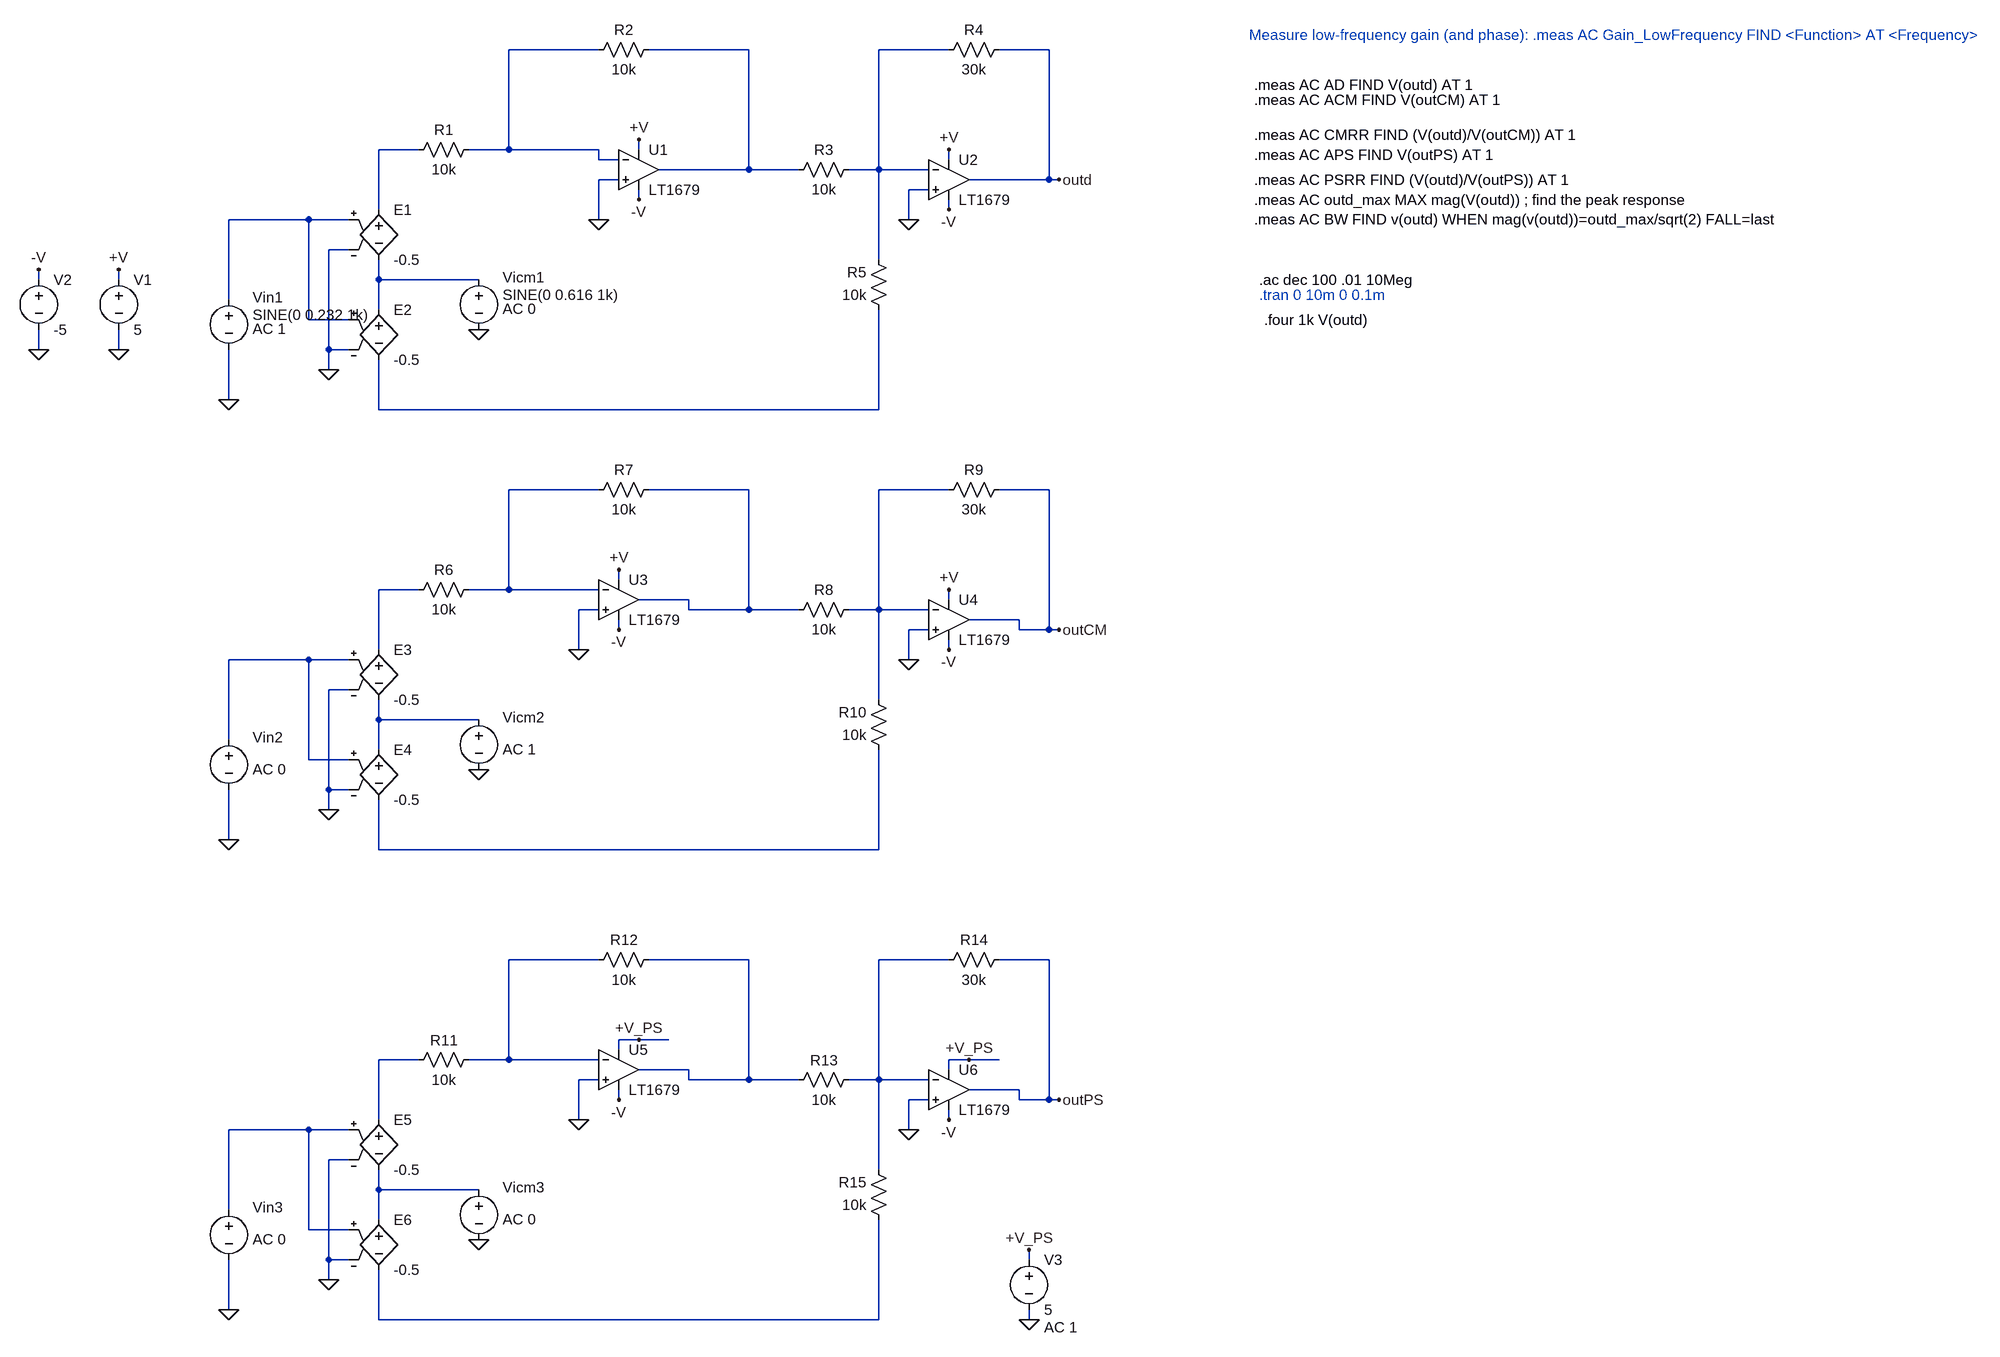
[diagram p0: schematic Etaj_1_AI_2AO_inv_AC.asc]
Etaj_1_AI_2AO_inv_AC.asc, the LTspice schematic file:
Version 4.1
SHEET 1 2388 2108
WIRE 96 48 -48 48
WIRE 336 48 176 48
WIRE 656 48 544 48
WIRE 816 48 736 48
WIRE -192 208 -256 208
WIRE -48 208 -48 48
WIRE -48 208 -112 208
WIRE 96 208 -48 208
WIRE 160 208 160 192
WIRE 96 224 96 208
WIRE 128 224 96 224
WIRE 656 224 656 208
WIRE 336 240 336 48
WIRE 336 240 192 240
WIRE 416 240 336 240
WIRE 544 240 544 48
WIRE 544 240 496 240
WIRE 624 240 544 240
WIRE 128 256 96 256
WIRE 816 256 816 48
WIRE 816 256 688 256
WIRE 832 256 816 256
WIRE 624 272 592 272
WIRE 160 288 160 272
WIRE -256 304 -256 208
WIRE 656 304 656 288
WIRE -368 320 -496 320
WIRE -304 320 -368 320
WIRE 96 320 96 256
WIRE 592 320 592 272
WIRE -304 368 -336 368
WIRE 544 384 544 240
WIRE -800 416 -800 400
WIRE -672 416 -672 400
WIRE -256 416 -256 384
WIRE -96 416 -256 416
WIRE -496 448 -496 320
WIRE -256 464 -256 416
WIRE -368 480 -368 320
WIRE -304 480 -368 480
WIRE -800 528 -800 496
WIRE -672 528 -672 496
WIRE -336 528 -336 368
WIRE -304 528 -336 528
WIRE -336 560 -336 528
WIRE -496 608 -496 528
WIRE -256 624 -256 544
WIRE 544 624 544 464
WIRE 544 624 -256 624
WIRE 96 752 -48 752
WIRE 336 752 176 752
WIRE 656 752 544 752
WIRE 816 752 736 752
WIRE 128 896 128 880
WIRE -192 912 -256 912
WIRE -48 912 -48 752
WIRE -48 912 -112 912
WIRE 96 912 -48 912
WIRE 240 928 160 928
WIRE 656 928 656 912
WIRE 96 944 64 944
WIRE 240 944 240 928
WIRE 336 944 336 752
WIRE 336 944 240 944
WIRE 416 944 336 944
WIRE 544 944 544 752
WIRE 544 944 496 944
WIRE 624 944 544 944
WIRE 768 960 688 960
WIRE 128 976 128 960
WIRE 624 976 592 976
WIRE 768 976 768 960
WIRE 816 976 816 752
WIRE 816 976 768 976
WIRE 832 976 816 976
WIRE -256 1008 -256 912
WIRE 64 1008 64 944
WIRE 656 1008 656 992
WIRE -368 1024 -496 1024
WIRE -304 1024 -368 1024
WIRE 592 1024 592 976
WIRE -304 1072 -336 1072
WIRE 544 1088 544 944
WIRE -256 1120 -256 1088
WIRE -96 1120 -256 1120
WIRE -496 1152 -496 1024
WIRE -256 1168 -256 1120
WIRE -368 1184 -368 1024
WIRE -304 1184 -368 1184
WIRE -336 1232 -336 1072
WIRE -304 1232 -336 1232
WIRE -336 1264 -336 1232
WIRE -496 1312 -496 1232
WIRE -256 1328 -256 1248
WIRE 544 1328 544 1168
WIRE 544 1328 -256 1328
WIRE 96 1504 -48 1504
WIRE 336 1504 176 1504
WIRE 656 1504 544 1504
WIRE 816 1504 736 1504
WIRE 160 1632 128 1632
WIRE 208 1632 160 1632
WIRE 128 1648 128 1632
WIRE -192 1664 -256 1664
WIRE -48 1664 -48 1504
WIRE -48 1664 -112 1664
WIRE 96 1664 -48 1664
WIRE 688 1664 656 1664
WIRE 736 1664 688 1664
WIRE 240 1680 160 1680
WIRE 656 1680 656 1664
WIRE 96 1696 64 1696
WIRE 240 1696 240 1680
WIRE 336 1696 336 1504
WIRE 336 1696 240 1696
WIRE 416 1696 336 1696
WIRE 544 1696 544 1504
WIRE 544 1696 496 1696
WIRE 624 1696 544 1696
WIRE 768 1712 688 1712
WIRE 128 1728 128 1712
WIRE 624 1728 592 1728
WIRE 768 1728 768 1712
WIRE 816 1728 816 1504
WIRE 816 1728 768 1728
WIRE 832 1728 816 1728
WIRE -256 1760 -256 1664
WIRE 64 1760 64 1696
WIRE 656 1760 656 1744
WIRE -368 1776 -496 1776
WIRE -304 1776 -368 1776
WIRE 592 1776 592 1728
WIRE -304 1824 -336 1824
WIRE 544 1840 544 1696
WIRE -256 1872 -256 1840
WIRE -96 1872 -256 1872
WIRE -496 1904 -496 1776
WIRE -256 1920 -256 1872
WIRE -368 1936 -368 1776
WIRE -304 1936 -368 1936
WIRE -336 1984 -336 1824
WIRE -304 1984 -336 1984
WIRE 784 1984 784 1968
WIRE -336 2016 -336 1984
WIRE -496 2064 -496 1984
WIRE -256 2080 -256 2000
WIRE 544 2080 544 1920
WIRE 544 2080 -256 2080
WIRE 784 2080 784 2064
FLAG -672 528 0
FLAG 160 192 +V
FLAG -672 400 +V
FLAG 160 288 -V
FLAG -800 528 0
FLAG -800 400 -V
FLAG 656 208 +V
FLAG 656 304 -V
FLAG 832 256 outd
FLAG 96 320 0
FLAG 592 320 0
FLAG -496 608 0
FLAG -336 560 0
FLAG -96 496 0
FLAG 128 880 +V
FLAG 128 976 -V
FLAG 656 912 +V
FLAG 656 1008 -V
FLAG 832 976 outCM
FLAG 64 1008 0
FLAG 592 1024 0
FLAG -496 1312 0
FLAG -336 1264 0
FLAG -96 1200 0
FLAG 128 1728 -V
FLAG 656 1760 -V
FLAG 832 1728 outPS
FLAG 64 1760 0
FLAG 592 1776 0
FLAG -496 2064 0
FLAG -336 2016 0
FLAG -96 1952 0
FLAG 784 2080 0
FLAG 784 1968 +V_PS
FLAG 688 1664 +V_PS
FLAG 160 1632 +V_PS
SYMBOL voltage -672 400 R0
WINDOW 123 0 0 Left 2
WINDOW 39 0 0 Left 2
SYMATTR InstName V1
SYMATTR Value 5
SYMBOL voltage -800 400 R0
WINDOW 123 0 0 Left 2
WINDOW 39 0 0 Left 2
SYMATTR InstName V2
SYMATTR Value -5
SYMBOL res -96 192 R90
WINDOW 0 0 56 VBottom 2
WINDOW 3 32 56 VTop 2
SYMATTR InstName R1
SYMATTR Value 10k
SYMBOL res 192 32 R90
WINDOW 0 0 56 VBottom 2
WINDOW 3 32 56 VTop 2
SYMATTR InstName R2
SYMATTR Value 10k
SYMBOL res 512 224 R90
WINDOW 0 0 56 VBottom 2
WINDOW 3 32 56 VTop 2
SYMATTR InstName R3
SYMATTR Value 10k
SYMBOL res 752 32 R90
WINDOW 0 0 56 VBottom 2
WINDOW 3 32 56 VTop 2
SYMATTR InstName R4
SYMATTR Value 30k
SYMBOL res 560 480 R180
WINDOW 0 36 76 Left 2
WINDOW 3 36 40 Left 2
SYMATTR InstName R5
SYMATTR Value 10k
SYMBOL voltage -496 432 R0
WINDOW 123 38 63 Left 2
WINDOW 39 0 0 Left 2
WINDOW 0 38 12 Left 2
WINDOW 3 38 40 Left 2
SYMATTR Value2 AC 1
SYMATTR InstName Vin1
SYMATTR Value SINE(0 0.232 1k)
SYMBOL e -256 288 R0
SYMATTR InstName E1
SYMATTR Value -0.5
SYMBOL e -256 448 R0
SYMATTR InstName E2
SYMATTR Value -0.5
SYMBOL voltage -96 400 R0
WINDOW 123 38 63 Left 2
WINDOW 39 0 0 Left 2
WINDOW 0 38 12 Left 2
WINDOW 3 38 40 Left 2
SYMATTR Value2 AC 0
SYMATTR InstName Vicm1
SYMATTR Value SINE(0 0.616 1k)
SYMBOL res -96 896 R90
WINDOW 0 0 56 VBottom 2
WINDOW 3 32 56 VTop 2
SYMATTR InstName R6
SYMATTR Value 10k
SYMBOL res 192 736 R90
WINDOW 0 0 56 VBottom 2
WINDOW 3 32 56 VTop 2
SYMATTR InstName R7
SYMATTR Value 10k
SYMBOL res 512 928 R90
WINDOW 0 0 56 VBottom 2
WINDOW 3 32 56 VTop 2
SYMATTR InstName R8
SYMATTR Value 10k
SYMBOL res 752 736 R90
WINDOW 0 0 56 VBottom 2
WINDOW 3 32 56 VTop 2
SYMATTR InstName R9
SYMATTR Value 30k
SYMBOL res 560 1184 R180
WINDOW 0 36 76 Left 2
WINDOW 3 36 40 Left 2
SYMATTR InstName R10
SYMATTR Value 10k
SYMBOL voltage -496 1136 R0
WINDOW 123 38 63 Left 2
WINDOW 39 0 0 Left 2
WINDOW 0 38 12 Left 2
WINDOW 3 -188 38 Left 2
SYMATTR Value2 AC 0
SYMATTR InstName Vin2
SYMATTR Value ""
SYMBOL e -256 992 R0
SYMATTR InstName E3
SYMATTR Value -0.5
SYMBOL e -256 1152 R0
SYMATTR InstName E4
SYMATTR Value -0.5
SYMBOL voltage -96 1104 R0
WINDOW 123 38 63 Left 2
WINDOW 39 0 0 Left 2
WINDOW 0 38 12 Left 2
WINDOW 3 -188 38 Left 2
SYMATTR Value2 AC 1
SYMATTR InstName Vicm2
SYMATTR Value ""
SYMBOL res -96 1648 R90
WINDOW 0 0 56 VBottom 2
WINDOW 3 32 56 VTop 2
SYMATTR InstName R11
SYMATTR Value 10k
SYMBOL res 192 1488 R90
WINDOW 0 0 56 VBottom 2
WINDOW 3 32 56 VTop 2
SYMATTR InstName R12
SYMATTR Value 10k
SYMBOL res 512 1680 R90
WINDOW 0 0 56 VBottom 2
WINDOW 3 32 56 VTop 2
SYMATTR InstName R13
SYMATTR Value 10k
SYMBOL res 752 1488 R90
WINDOW 0 0 56 VBottom 2
WINDOW 3 32 56 VTop 2
SYMATTR InstName R14
SYMATTR Value 30k
SYMBOL res 560 1936 R180
WINDOW 0 36 76 Left 2
WINDOW 3 36 40 Left 2
SYMATTR InstName R15
SYMATTR Value 10k
SYMBOL voltage -496 1888 R0
WINDOW 123 38 63 Left 2
WINDOW 39 0 0 Left 2
WINDOW 0 38 12 Left 2
WINDOW 3 -188 38 Left 2
SYMATTR Value2 AC 0
SYMATTR InstName Vin3
SYMATTR Value ""
SYMBOL e -256 1744 R0
SYMATTR InstName E5
SYMATTR Value -0.5
SYMBOL e -256 1904 R0
SYMATTR InstName E6
SYMATTR Value -0.5
SYMBOL voltage -96 1856 R0
WINDOW 123 38 63 Left 2
WINDOW 39 0 0 Left 2
WINDOW 0 38 12 Left 2
WINDOW 3 -188 38 Left 2
SYMATTR Value2 AC 0
SYMATTR InstName Vicm3
SYMATTR Value ""
SYMBOL voltage 784 1968 R0
WINDOW 123 24 124 Left 2
WINDOW 39 0 0 Left 2
SYMATTR Value2 AC 1
SYMATTR InstName V3
SYMATTR Value 5
SYMBOL OpAmps\\LT1679 160 240 R0
SYMATTR InstName U1
SYMBOL OpAmps\\LT1679 656 256 R0
SYMATTR InstName U2
SYMBOL OpAmps\\LT1679 128 928 R0
SYMATTR InstName U3
SYMBOL OpAmps\\LT1679 656 960 R0
SYMATTR InstName U4
SYMBOL OpAmps\\LT1679 128 1680 R0
SYMATTR InstName U5
SYMBOL OpAmps\\LT1679 656 1712 R0
SYMATTR InstName U6
TEXT 1152 416 Left 2 !.ac dec 100 .01 10Meg
TEXT 1144 104 Left 2 !.meas AC AD FIND V(outd) AT 1
TEXT 1136 24 Left 2 ;Measure low-frequency gain (and phase): .meas AC Gain_LowFrequency FIND <Function> AT <Frequency>
TEXT 1144 128 Left 2 !.meas AC ACM FIND V(outCM) AT 1
TEXT 1144 184 Left 2 !.meas AC CMRR FIND (V(outd)/V(outCM)) AT 1
TEXT 1144 256 Left 2 !.meas AC PSRR FIND (V(outd)/V(outPS)) AT 1
TEXT 1144 216 Left 2 !.meas AC APS FIND V(outPS) AT 1
TEXT 1144 288 Left 2 !.meas AC outd_max MAX mag(V(outd)) ; find the peak response\n.meas AC BW FIND v(outd) WHEN mag(v(outd))=outd_max/sqrt(2) FALL=last
TEXT 1152 440 Left 2 ;.tran 0 10m 0 0.1m
TEXT 1160 480 Left 2 !.four 1k V(outd)

The netlist it stands for:
* Etaj_1_AI_2AO_inv_AC.asc
V1 +V 0 5
V2 -V 0 -5
R1 N001 N004 10k
R2 N002 N001 10k
R3 N003 N002 10k
R4 outd N003 30k
R5 N007 N003 10k
Vin1 N005 0 SINE(0 0.232 1k) AC 1
E1 N004 N006 N005 0 -0.5
E2 N006 N007 N005 0 -0.5
Vicm1 N006 0 SINE(0 0.616 1k) AC 0
R6 N008 N011 10k
R7 N009 N008 10k
R8 N010 N009 10k
R9 outCM N010 30k
R10 N014 N010 10k
Vin2 N012 0 AC 0
E3 N011 N013 N012 0 -0.5
E4 N013 N014 N012 0 -0.5
Vicm2 N013 0 AC 1
R11 N015 N018 10k
R12 N016 N015 10k
R13 N017 N016 10k
R14 outPS N017 30k
R15 N021 N017 10k
Vin3 N019 0 AC 0
E5 N018 N020 N019 0 -0.5
E6 N020 N021 N019 0 -0.5
Vicm3 N020 0 AC 0
V3 +V_PS 0 5 AC 1
* U1: LT1679 (symbol OpAmps\LT1679 not available, pins judged from their places): In+=0 In-=N001 V+=+V V-=-V OUT=N002
* U2: LT1679 (symbol OpAmps\LT1679 not available, pins judged from their places): In+=0 In-=N003 V+=+V V-=-V OUT=outd
* U3: LT1679 (symbol OpAmps\LT1679 not available, pins judged from their places): In+=0 In-=N008 V+=+V V-=-V OUT=N009
* U4: LT1679 (symbol OpAmps\LT1679 not available, pins judged from their places): In+=0 In-=N010 V+=+V V-=-V OUT=outCM
* U5: LT1679 (symbol OpAmps\LT1679 not available, pins judged from their places): In+=0 In-=N015 V+=+V_PS V-=-V OUT=N016
* U6: LT1679 (symbol OpAmps\LT1679 not available, pins judged from their places): In+=0 In-=N017 V+=+V_PS V-=-V OUT=outPS
.ac dec 100 .01 10Meg
.meas AC AD FIND V(outd) AT 1
* Measure low-frequency gain (and phase): .meas AC Gain_LowFrequency FIND <Function> AT <Frequency>
.meas AC ACM FIND V(outCM) AT 1
.meas AC CMRR FIND (V(outd)/V(outCM)) AT 1
.meas AC PSRR FIND (V(outd)/V(outPS)) AT 1
.meas AC APS FIND V(outPS) AT 1
.meas AC outd_max MAX mag(V(outd)) ; find the peak response
.meas AC BW FIND v(outd) WHEN mag(v(outd))=outd_max/sqrt(2) FALL=last
* .tran 0 10m 0 0.1m
.four 1k V(outd)
.backanno
.end